# EAGLE schematic MAX31855T_BREAKOUT (EAGLE 7.2.0)
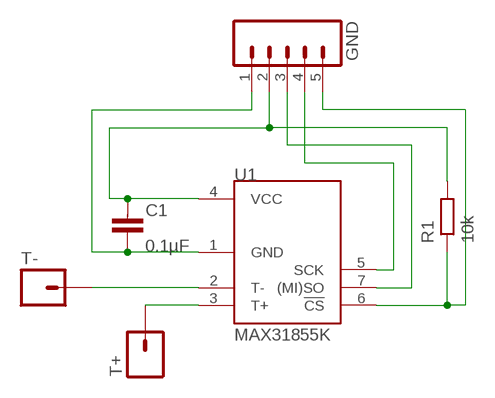
[diagram p0: schematic, sheet 1]

## Parts
C1  0.1µF  CAPACITOR0805-L  [C0805-L]
GND  M05PTH  [1X05]
R1  10k  RESISTOR0603-N  [R0603-N]
T+  M01SMD  [LUXEON-PAD]
T-  M01SMD  [LUXEON-PAD]
U1  MAX31855K  [SOIC8]

## Nets
CS: GND.5 R1.1 U1.6(!CS)
MISO: GND.3 U1.7((MI)SO)
N$2: C1.2 GND.1 U1.1(GND)
N$3: T-.P$1 U1.2(T-)
N$4: T+.P$1 U1.3(T+)
N$5: C1.1 GND.2 R1.2 U1.4(VCC)
SCK: GND.4 U1.5(SCK)

## Library data of the parts
C1 = passives-7351:CAPACITOR
GND = SparkFun-Connectors:M05: Header 5 Standard 5-pin 0.1" header. Use with straight break away headers (SKU : PRT-00116), right angle break away headers (PRT-00553), swiss pins (PRT-00743), machine pins (PRT-00117), and female headers (PRT-00115). Molex polarized connector foot print use with SKU : PRT-08230 with associated crimp pins and housings.
R1 = passives-7351:RESISTOR
T+ T- = SparkFun-Connectors:M01: Header 1 Standard 1-pin 0.1" header. Use with straight break away headers (SKU : PRT-00116), right angle break away headers (PRT-00553), swiss pins (PRT-00743), machine pins (PRT-00117), and female headers (PRT-00115). SMTSO-256-ET is a "flush mount" nut for a 4-40 screw. The older package used to be too tight, and did not allow it to sit properly thru the drill hit. The latest (0.165DIA) fits nice and snug.
U1 = SparkFun-AnalogIC:MAX31855K: Cold-Junction-Compensated K-Thermocoupleto-Digital Converter (-270°C to +1800°C) The MAX31855K performs cold-junction compensation and digitizes the signal from a type-K thermocouple. The data is output in a 14-bit resolution, SPI™-compatible, read-only format. This converter resolves temperatures to 0.25°C, allows readings as high as +1800°C and as low as -270°C, and exhibits thermocouple accuracy of ±2°C for temperatures ranging from -200°C to +700°C for K-type thermocouples.